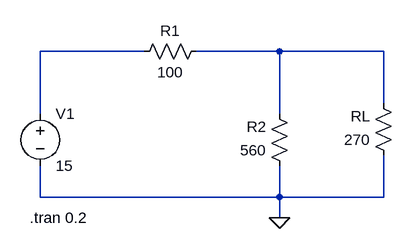
[diagram p0: schematic Thevenin.asc]
Thevenin.asc, the LTspice schematic file:
Version 4
SHEET 1 880 680
WIRE 336 224 176 224
WIRE 544 224 416 224
WIRE 704 224 544 224
WIRE 704 304 704 224
WIRE 176 320 176 224
WIRE 544 320 544 224
WIRE 176 448 176 400
WIRE 544 448 544 400
WIRE 544 448 176 448
WIRE 704 448 704 384
WIRE 704 448 544 448
WIRE 544 480 544 448
FLAG 544 480 0
SYMBOL voltage 176 304 R0
SYMATTR InstName V1
SYMATTR Value 15
SYMBOL Res 432 208 R90
WINDOW 0 0 56 VBottom 2
WINDOW 3 32 56 VTop 2
SYMATTR InstName R1
SYMATTR Value 100
SYMBOL Res 560 416 R180
WINDOW 0 36 76 Left 2
WINDOW 3 36 40 Left 2
SYMATTR InstName R2
SYMATTR Value 560
SYMBOL res 720 400 R180
WINDOW 0 36 76 Left 2
WINDOW 3 36 40 Left 2
SYMATTR InstName RL
SYMATTR Value 270
TEXT 160 480 Left 2 !.tran 0.2

The netlist it stands for:
* Thevenin.asc
V1 N001 0 15
R1 N002 N001 100
R2 0 N002 560
RL 0 N002 270
.tran 0.2
.backanno
.end